# Altium schematic sheet Top.SchDoc
size Letter; Organization: MIT; SheetNumber: 1; SheetTotal: 5; Section: Section
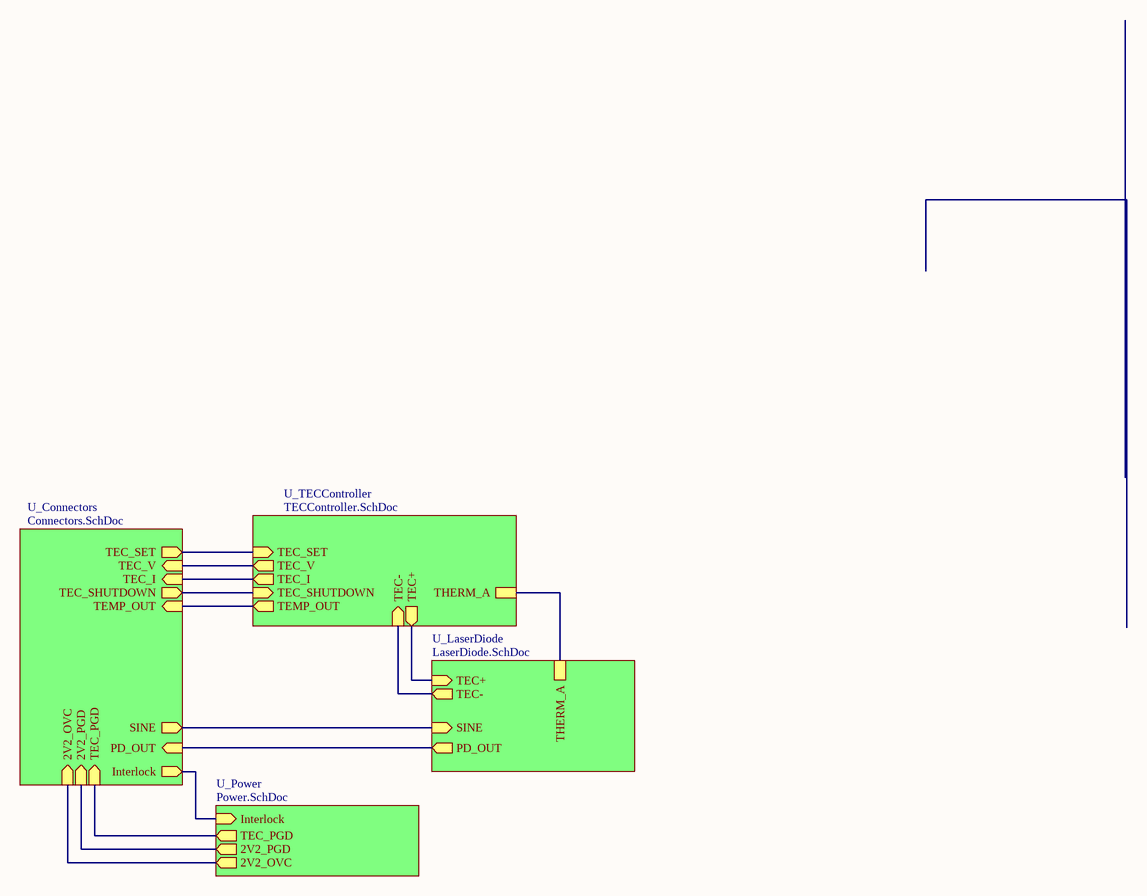
[diagram p0: Top.SchDoc]

## Sub-sheets
U_Connectors = Connectors.SchDoc: Interlock (out), SINE (out), TEC_SHUTDOWN (out), PD_OUT (in), TEMP_OUT (in), TEC_I (in), TEC_V (in), TEC_SET (out), 2V2_PGD (in), 2V2_OVC (in), TEC_PGD (in)
U_LaserDiode = LaserDiode.SchDoc: PD_OUT (out), TEC+ (in), TEC- (out), SINE (in), THERM_A
U_Power = Power.SchDoc: Interlock (in), TEC_PGD (out), 2V2_OVC (out), 2V2_PGD (out)
U_TECController = TECController.SchDoc: TEC_I (out), TEC_V (out), TEC_SET (in), TEC+ (out), TEC- (in), TEC_SHUTDOWN (in), TEMP_OUT (out), THERM_A

## Nets
(unnamed): sheet U_Connectors/Interlock, sheet U_Power/Interlock
(unnamed): sheet U_Connectors/SINE, sheet U_LaserDiode/SINE
(unnamed): sheet U_Connectors/TEC_SHUTDOWN, sheet U_TECController/TEC_SHUTDOWN
(unnamed): sheet U_Connectors/PD_OUT, sheet U_LaserDiode/PD_OUT
(unnamed): sheet U_Connectors/TEMP_OUT, sheet U_TECController/TEMP_OUT
(unnamed): sheet U_Connectors/TEC_I, sheet U_TECController/TEC_I
(unnamed): sheet U_Connectors/TEC_V, sheet U_TECController/TEC_V
(unnamed): sheet U_Connectors/TEC_SET, sheet U_TECController/TEC_SET
(unnamed): sheet U_Connectors/2V2_PGD, sheet U_Power/2V2_PGD
(unnamed): sheet U_Connectors/2V2_OVC, sheet U_Power/2V2_OVC
(unnamed): sheet U_Connectors/TEC_PGD, sheet U_Power/TEC_PGD
(unnamed): sheet U_LaserDiode/TEC+, sheet U_TECController/TEC+
(unnamed): sheet U_LaserDiode/TEC-, sheet U_TECController/TEC-
(unnamed): sheet U_LaserDiode/THERM_A, sheet U_TECController/THERM_A

## Notes on the sheet
- Title
- Size
- Date
- Letter
- Section
- Time
- Sheet
- of
- Revision
- Drawn
- 33-207 / 77 Mass. Ave.
- Cambridge, MA 02139
- File